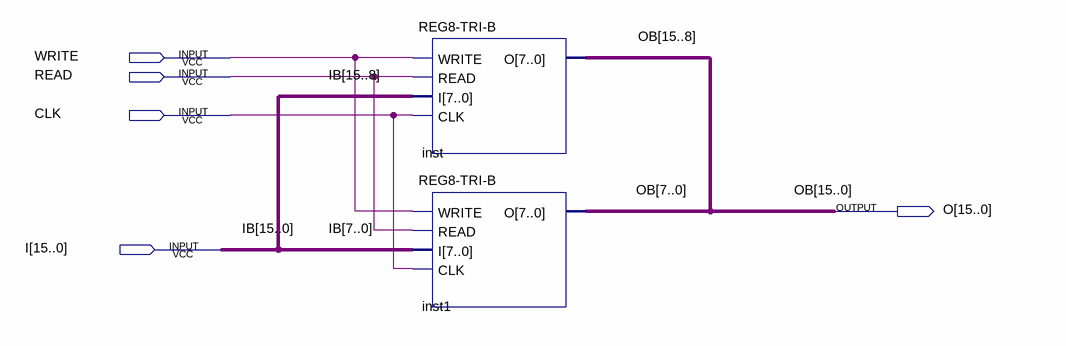
[diagram p0: schematic sheet]
// Quartus schematic REG-16-TRI-B.bdf as structural Verilog: 2 symbols, 5 pins
module \REG-16-TRI-B  (
  input  WRITE,
  input  READ,
  input  CLK,
  input  [15:0] I,
  output [15:0] O
);

  \REG8-TRI-B  inst (.WRITE(WRITE), .READ(READ), .I(I[15:8]), .CLK(CLK), .O(O[15:8]));
  \REG8-TRI-B  inst1 (.WRITE(WRITE), .READ(READ), .I(I[7:0]), .CLK(CLK), .O(O[7:0]));

  // Other names for the same wires on the sheet: IB[15:0] = I; OB[15:0] = O
endmodule
